# EAGLE schematic power_disrtibution (EAGLE 9.2.0)
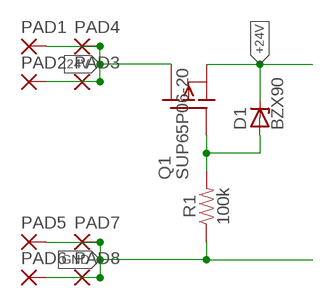
[diagram p0: schematic, sheet 1]

## Parts
D1  BZX90  [DO34Z7]
PAD1  SMD5  [SMD2,54-5,08]
PAD2  SMD5  [SMD2,54-5,08]
PAD3  SMD5  [SMD2,54-5,08]
PAD4  SMD5  [SMD2,54-5,08]
PAD5  SMD5  [SMD2,54-5,08]
PAD6  SMD5  [SMD2,54-5,08]
PAD7  SMD5  [SMD2,54-5,08]
PAD8  SMD5  [SMD2,54-5,08]
Q1  SUP65P06-20  [TO220]
R1  100k  100KOHM-HORIZ-1/4W-5%  [AXIAL-0.3]

## Nets
24V: PAD1.1(P) PAD2.1(P) PAD3.1(P) PAD4.1(P) Q1.2(D)
+24V: D1.C Q1.3(S)
GND: PAD5.1(P) PAD6.1(P) PAD7.1(P) PAD8.1(P) R1.P$1
N$2: D1.A Q1.1(G) R1.P$2

## Library data of the parts
D1 = diode:BZX90: Z DIODE
PAD1-PAD8 = wirepad:SMD5: SMD PAD
Q1 = transistor-fet:SUP65P06-20: P-Channel Enhancement MOSFET -60V; 60A; 0,020Ohm
R1 = SparkFun-Resistors:100KOHM: 100kΩ resistor A resistor is a passive two-terminal electrical component that implements electrical resistance as a circuit element. Resistors act to reduce current flow, and, at the same time, act to lower voltage levels within circuits. - Wikipedia; PROD_ID: RES-10686